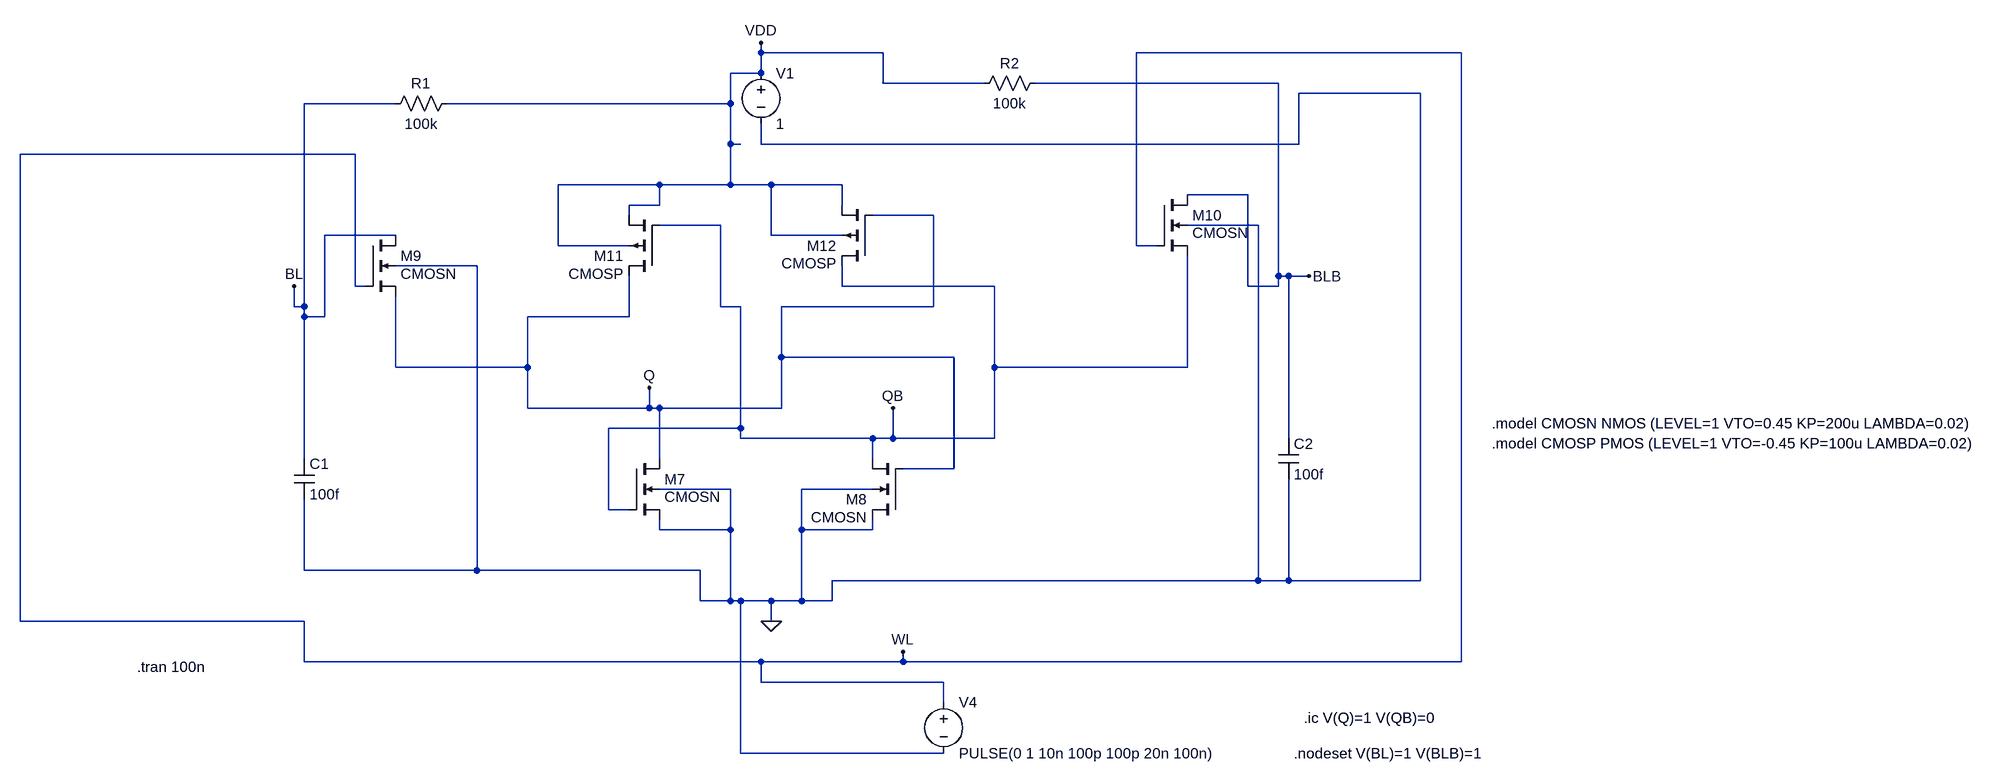
[diagram p0: schematic SRAM_6T_READ_with_cap.asc]
SRAM_6T_READ_with_cap.asc, the LTspice schematic file:
Version 4
SHEET 1 2200 680
WIRE 272 -688 272 -704
WIRE 464 -688 272 -688
WIRE 1376 -688 864 -688
WIRE 272 -656 272 -688
WIRE 272 -656 224 -656
WIRE 464 -640 464 -688
WIRE 624 -640 464 -640
WIRE 1088 -640 704 -640
WIRE 1312 -624 1120 -624
WIRE -304 -608 -448 -608
WIRE 224 -608 224 -656
WIRE 224 -608 -224 -608
WIRE 224 -544 224 -608
WIRE 240 -544 224 -544
WIRE 272 -544 272 -576
WIRE 1120 -544 1120 -624
WIRE 1120 -544 272 -544
WIRE -368 -528 -896 -528
WIRE 112 -480 -48 -480
WIRE 224 -480 224 -544
WIRE 224 -480 112 -480
WIRE 288 -480 224 -480
WIRE 400 -480 288 -480
WIRE 1040 -464 944 -464
WIRE 112 -448 112 -480
WIRE 112 -448 64 -448
WIRE 400 -448 400 -480
WIRE 64 -432 64 -448
WIRE 544 -432 448 -432
WIRE 208 -416 112 -416
WIRE 1056 -416 944 -416
WIRE -304 -400 -416 -400
WIRE 288 -400 288 -480
WIRE 400 -400 288 -400
WIRE -48 -384 -48 -480
WIRE 64 -384 -48 -384
WIRE 864 -384 864 -688
WIRE 896 -384 864 -384
WIRE -176 -352 -304 -352
WIRE 1088 -336 1088 -640
WIRE 1104 -336 1088 -336
WIRE 1136 -336 1104 -336
WIRE -368 -320 -368 -528
WIRE -352 -320 -368 -320
WIRE 400 -320 400 -352
WIRE 640 -320 400 -320
WIRE 1040 -320 1040 -464
WIRE 1088 -320 1088 -336
WIRE 1088 -320 1040 -320
WIRE -464 -288 -464 -320
WIRE -448 -288 -448 -608
WIRE -448 -288 -464 -288
WIRE 208 -288 208 -416
WIRE 240 -288 208 -288
WIRE 544 -288 544 -432
WIRE 544 -288 304 -288
WIRE -448 -272 -448 -288
WIRE -416 -272 -416 -400
WIRE -416 -272 -448 -272
WIRE 64 -272 64 -336
WIRE 64 -272 -96 -272
WIRE 304 -208 304 -288
WIRE 576 -208 304 -208
WIRE -304 -192 -304 -304
WIRE -96 -192 -96 -272
WIRE -96 -192 -304 -192
WIRE 640 -192 640 -320
WIRE 944 -192 944 -368
WIRE 944 -192 640 -192
WIRE -96 -128 -96 -192
WIRE 96 -128 96 -160
WIRE 96 -128 -96 -128
WIRE 112 -128 96 -128
WIRE 304 -128 304 -208
WIRE 304 -128 112 -128
WIRE 240 -96 240 -288
WIRE 240 -96 32 -96
WIRE 240 -80 240 -96
WIRE 448 -80 240 -80
WIRE 480 -80 480 -128
WIRE 480 -80 448 -80
WIRE 640 -80 640 -192
WIRE 640 -80 480 -80
WIRE 1104 -80 1104 -336
WIRE -448 -48 -448 -272
WIRE 112 -48 112 -128
WIRE 448 -48 448 -80
WIRE 576 -32 576 -208
WIRE 576 -32 496 -32
WIRE 224 0 112 0
WIRE 448 0 336 0
WIRE 32 32 32 -96
WIRE 64 32 32 32
WIRE 112 64 112 48
WIRE 224 64 224 0
WIRE 224 64 112 64
WIRE 336 64 336 0
WIRE 448 64 448 48
WIRE 448 64 336 64
WIRE -448 128 -448 16
WIRE -176 128 -176 -352
WIRE -176 128 -448 128
WIRE 176 128 -176 128
WIRE 1056 144 1056 -416
WIRE 1056 144 384 144
WIRE 1104 144 1104 -16
WIRE 1104 144 1056 144
WIRE 1312 144 1312 -624
WIRE 1312 144 1104 144
WIRE 176 176 176 128
WIRE 224 176 224 64
WIRE 224 176 176 176
WIRE 240 176 224 176
WIRE 288 176 240 176
WIRE 336 176 336 64
WIRE 336 176 288 176
WIRE 384 176 384 144
WIRE 384 176 336 176
WIRE -896 208 -896 -528
WIRE -448 208 -896 208
WIRE 288 208 288 176
WIRE -448 272 -448 208
WIRE 272 272 -448 272
WIRE 496 272 496 256
WIRE 496 272 272 272
WIRE 1376 272 1376 -688
WIRE 1376 272 496 272
WIRE 272 304 272 272
WIRE 560 304 272 304
WIRE 560 336 560 304
WIRE 240 416 240 176
WIRE 560 416 240 416
FLAG 288 208 0
FLAG -464 -320 BL
FLAG 1136 -336 BLB
FLAG 272 -704 VDD
FLAG 496 256 WL
FLAG 96 -160 Q
FLAG 480 -128 QB
SYMBOL voltage 272 -672 R0
WINDOW 123 0 0 Left 2
WINDOW 39 0 0 Left 2
SYMATTR InstName V1
SYMATTR Value 1
SYMBOL voltage 560 320 R0
WINDOW 123 0 0 Left 2
WINDOW 39 0 0 Left 2
SYMATTR InstName V4
SYMATTR Value PULSE(0 1 10n 100p 100p 20n 100n)
SYMBOL cmosn 64 -48 R0
WINDOW 3 56 60 Left 2
SYMATTR InstName M7
SYMBOL cmosn 496 48 R180
WINDOW 3 56 4 Left 2
SYMATTR InstName M8
SYMBOL cmosn -352 -400 R0
WINDOW 3 56 60 Left 2
SYMATTR InstName M9
SYMBOL cmosn 896 -464 R0
WINDOW 3 56 60 Left 2
SYMATTR InstName M10
SYMBOL cmosp 112 -336 R180
WINDOW 3 56 4 Left 2
SYMATTR InstName M11
SYMBOL cmosp 448 -352 R180
WINDOW 3 56 4 Left 2
SYMATTR InstName M12
SYMBOL res -208 -624 R90
WINDOW 0 0 56 VBottom 2
WINDOW 3 32 56 VTop 2
SYMATTR InstName R1
SYMATTR Value 100k
SYMBOL res 720 -656 R90
WINDOW 0 0 56 VBottom 2
WINDOW 3 32 56 VTop 2
SYMATTR InstName R2
SYMATTR Value 100k
SYMBOL cap -464 -48 R0
SYMATTR InstName C1
SYMATTR Value 100f
SYMBOL cap 1088 -80 R0
SYMATTR InstName C2
SYMATTR Value 100f
TEXT -712 280 Left 2 !.tran 100n
TEXT 1128 360 Left 2 !.ic V(Q)=1 V(QB)=0
TEXT 1424 -104 Left 2 !.model CMOSN NMOS (LEVEL=1 VTO=0.45 KP=200u LAMBDA=0.02)\n.model CMOSP PMOS (LEVEL=1 VTO=-0.45 KP=100u LAMBDA=0.02)
TEXT 1112 416 Left 2 !.nodeset V(BL)=1 V(BLB)=1

The netlist it stands for:
* SRAM_6T_READ_with_cap.asc
V1 VDD 0 1
V4 WL 0 PULSE(0 1 10n 100p 100p 20n 100n)
M7 Q QB 0 0 CMOSN
M8 0 Q QB 0 CMOSN
M9 BL WL Q 0 CMOSN
M10 BLB WL QB 0 CMOSN
M11 Q QB VDD VDD CMOSP
M12 QB Q VDD VDD CMOSP
R1 VDD BL 100k
R2 BLB VDD 100k
C1 BL 0 100f
C2 BLB 0 100f
.model NMOS NMOS
.model PMOS PMOS
.lib standard.mos
.tran 100n
.ic V(Q)=1 V(QB)=0
.model CMOSN NMOS (LEVEL=1 VTO=0.45 KP=200u LAMBDA=0.02)
.model CMOSP PMOS (LEVEL=1 VTO=-0.45 KP=100u LAMBDA=0.02)
.nodeset V(BL)=1 V(BLB)=1
.backanno
.end